# EAGLE design Binary_Blaster_v01 (EAGLE 6.4)
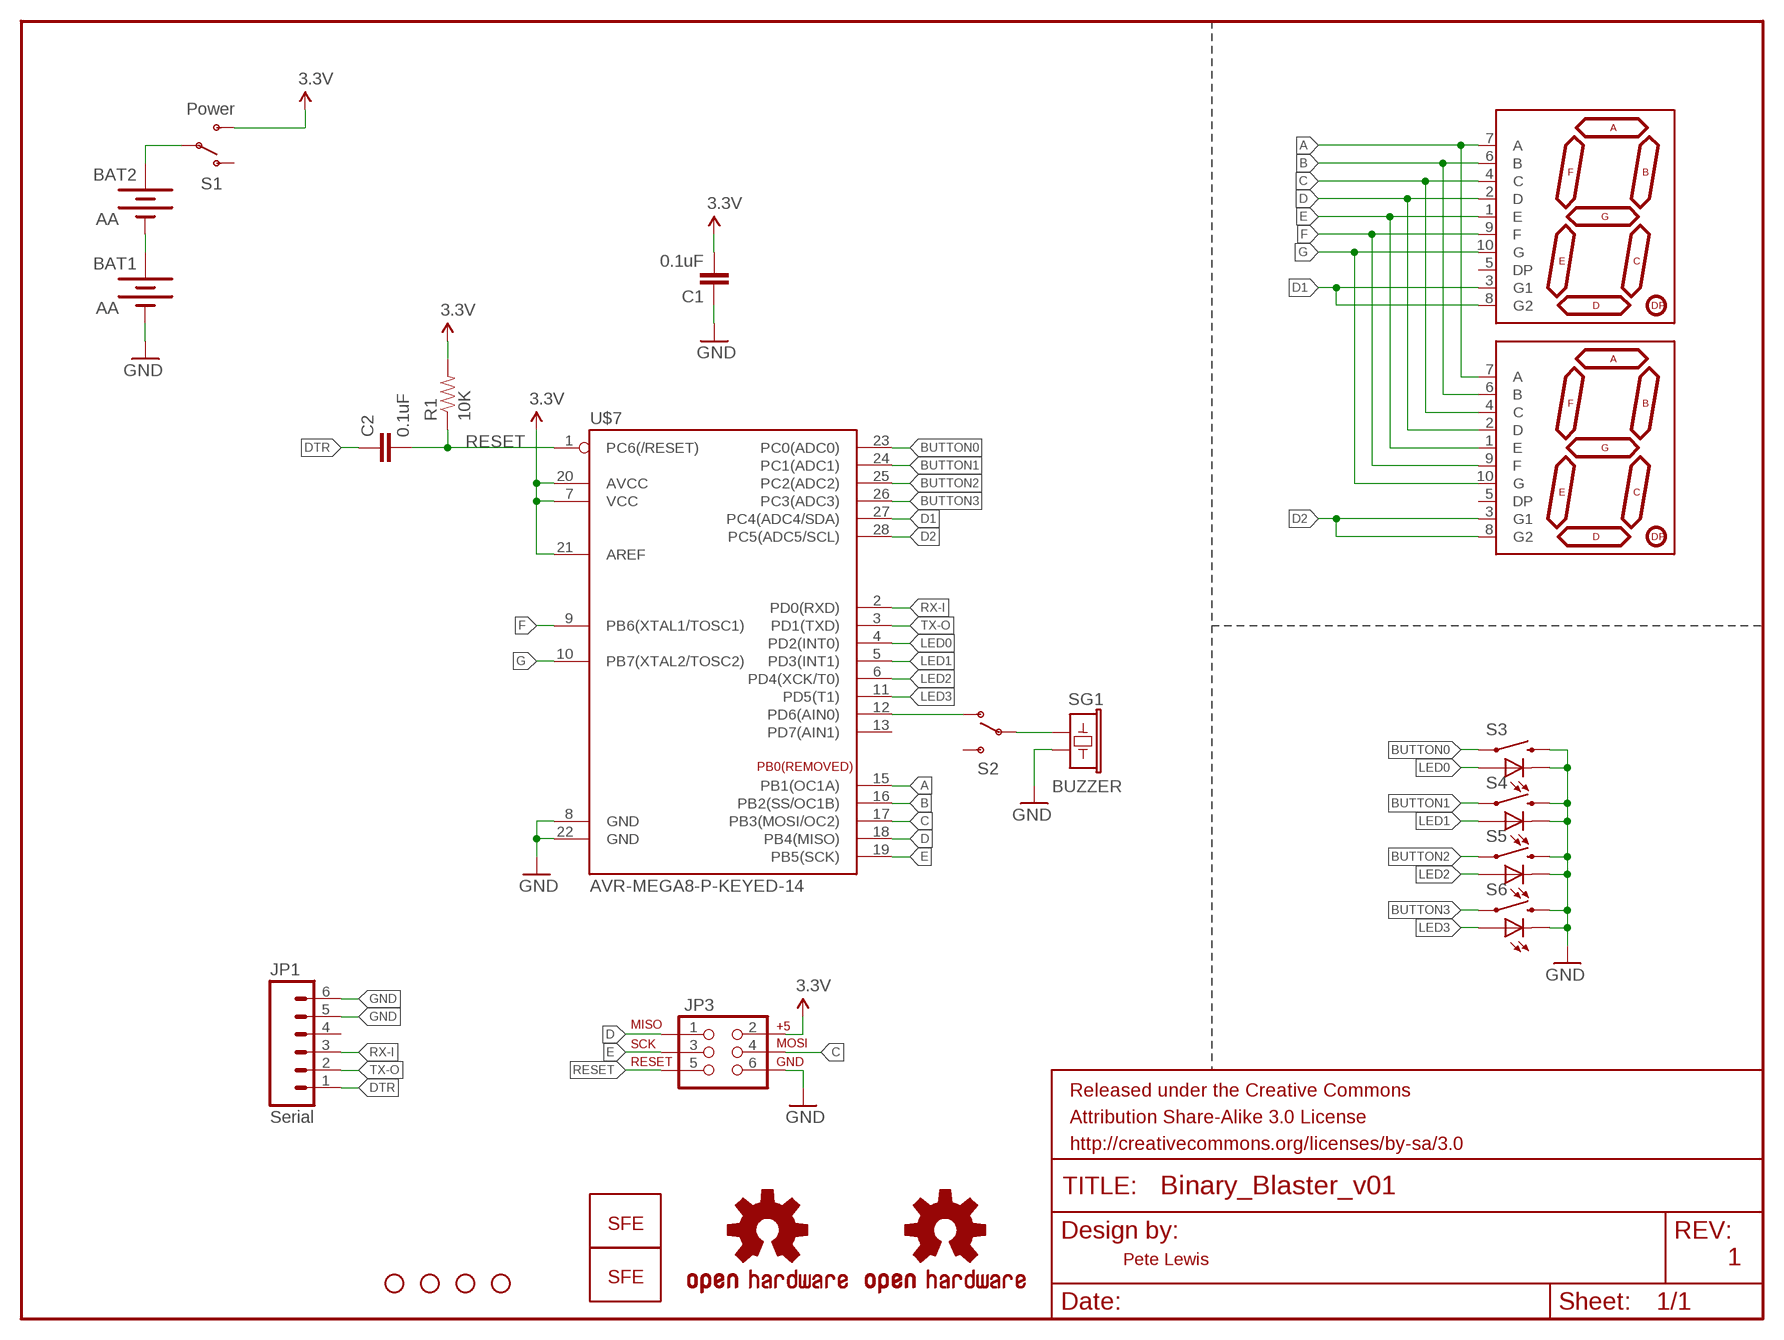
[diagram p0: schematic, sheet 1]

## Parts
BAT1  AA  BATTERYAA-KIT  [BATTERY-AA-KIT]
BAT2  AA  BATTERYAA-KIT  [BATTERY-AA-KIT]
C1  0.1uF  CAPCAP-PTH-SMALL-KIT  [CAP-PTH-SMALL-KIT]
C2  0.1uF  CAPCAP-PTH-SMALL-KIT  [CAP-PTH-SMALL-KIT]
FRAME1  FRAME-LETTER  [CREATIVE_COMMONS]
JP1  Serial  M06-SFENOSILK  [1X06-NOSILK]
JP2  STAND-OFF  [STAND-OFF]
JP3  AVR_SPI_PRG_6NS  [2X3-NS]
JP5  STAND-OFF  [STAND-OFF]
JP6  STAND-OFF  [STAND-OFF]
JP7  STAND-OFF  [STAND-OFF]
LOGO1  LOGO-SFENEW  [SFE-NEW-WEBLOGO]
LOGO2  LOGO-SFENEW  [SFE-NEW-WEBLOGO]
R1  10K  RESISTORKIT  [AXIAL-0.3-KIT]
S1  Power  SWITCH-SPSTKIT  [SWITCH-SPDT_KIT]
S2  SWITCH-SPSTKIT  [SWITCH-SPDT_KIT]
S3  SWITCH-MOMENTARY-LEDPTH  [TACTILE-PTH-LED-12MM]
S4  SWITCH-MOMENTARY-LEDPTH  [TACTILE-PTH-LED-12MM]
S5  SWITCH-MOMENTARY-LEDPTH  [TACTILE-PTH-LED-12MM]
S6  SWITCH-MOMENTARY-LEDPTH  [TACTILE-PTH-LED-12MM]
SG1  BUZZER  BUZZERKIT  [BUZZER-12MM-KIT]
U$2  OSHW-LOGOL  [OSHW-LOGO-L]
U$3  OSHW-LOGOS  [OSHW-LOGO-S]
U$4  7-SEGMENT-DISPLAYPTH  [7-SEGMENT-DISPLAY]
U$5  7-SEGMENT-DISPLAYPTH  [7-SEGMENT-DISPLAY]
U$7  AVR-MEGA8-P-KEYED-14  [DIL28-3_KEYED-14]

## Nets
3.3V: C1.2 JP3.2 R1.P$2 S1.3(S) U$7.7(VCC) U$7.20(AVCC) U$7.21(AREF)
A: U$4.7(A) U$5.7(A) U$7.15(PB1(OC1A))
B: U$4.6(B) U$5.6(B) U$7.16(PB2(SS/OC1B))
BUTTON0: S3.4 U$7.23(PC0(ADC0))
BUTTON1: S4.4 U$7.24(PC1(ADC1))
BUTTON2: S5.4 U$7.25(PC2(ADC2))
BUTTON3: S6.4 U$7.26(PC3(ADC3))
C: JP3.4 U$4.4(C) U$5.4(C) U$7.17(PB3(MOSI/OC2))
D: JP3.1 U$4.2(D) U$5.2(D) U$7.18(PB4(MISO))
D1: U$5.3(G1) U$5.8(G2) U$7.27(PC4(ADC4/SDA))
D2: U$4.3(G1) U$4.8(G2) U$7.28(PC5(ADC5/SCL))
DTR: C2.1 JP1.1
E: JP3.3 U$4.1(E) U$5.1(E) U$7.19(PB5(SCK))
F: U$4.9(F) U$5.9(F) U$7.9(PB6(XTAL1/TOSC1))
G: U$4.10(G) U$5.10(G) U$7.10(PB7(XTAL2/TOSC2))
GND: BAT1.GND@1(-) C1.1 JP1.5 JP1.6 JP3.6 S3.2 S3.C S4.2 S4.C S5.2 S5.C S6.2 S6.C SG1.- U$7.8(GND) U$7.22(GND)
LED0: S3.A U$7.4(PD2(INT0))
LED1: S4.A U$7.5(PD3(INT1))
LED2: S5.A U$7.6(PD4(XCK/T0))
LED3: S6.A U$7.11(PD5(T1))
N$1: S2.2(P) SG1.+
N$2: BAT2.PWR@1(+) S1.2(P)
N$3: S2.1(O) U$7.12(PD6(AIN0))
N$4: BAT1.PWR@1(+) BAT2.GND@1(-)
RESET: C2.2 JP3.5 R1.P$1 U$7.1(PC6(/RESET))
RX-I: JP1.3 U$7.2(PD0(RXD))
TX-O: JP1.2 U$7.3(PD1(TXD))
Unconnected: JP1.4 S1.1(O) S2.3(S) U$4.5(DP) U$5.5(DP) U$7.13(PD7(AIN1))

## Notes on the sheet
- Pete Lewis | 1

## Library data of the parts
BAT1 BAT2 = SparkFun:BATTERY: Battery Holders Various common sizes : AA, AAA, 20mm coin cell and 12mm coin cell.
C1 C2 = SparkFun:CAP: Capacitor Standard 0603 ceramic capacitor, and 0.1" leaded capacitor.
FRAME1 = SparkFun-Aesthetics:FRAME-LETTER: Schematic Frame Standard 8.5x11 US Letter frame
JP1 = unclepetes:M06-SFE: Header 6 Standard 6-pin 0.1" header. Use with straight break away headers (SKU : PRT-00116), right angle break away headers (PRT-00553), swiss pins (PRT-00743), machine pins (PRT-00117), and female headers (PRT-00115). Molex polarized connector foot print use with SKU : PRT-08094 with associated crimp pins and housings. NOTES ON THE VARIANTS LOCK and LOCK_LONGPADS... This footprint was designed to help hold the alignment of a through-hole component (i.e. 6-pin header) while soldering it into place. You may notice that each hole has been shifted either up or down by 0.005 of an inch from it's more standard position (which is a perfectly straight line). This slight alteration caused the pins (the squares in the middle) to touch the edges of the holes. Because they are alternating, it causes a "brace" to hold the component in place. 0.005 has proven to be the perfect amount of "off-center" position when using our standard breakaway headers. Although looks a little odd when you look at the bare footprint, once you have a header in there, the alteration is very hard to notice. Also, if you push a header all the way into place, it is covered up entirely on the bottom side. This idea of altering the position of holes to aid alignment will be further integrated into the Sparkfun Library for other footprints. It can help hold any component with 3 or more connection pins.
JP2 JP5-JP7 = SparkFun:STAND-OFF: Stand Off This is the mechanical footprint for a #4 phillips button head screw. Use the keepout ring to avoid running the screw head into surrounding components. SKU : PRT-00447
JP3 = SparkFun:AVR_SPI_PRG_6: AVR ISP 6 Pin This is the reduced ISP connector for AVR programming. Common on Arduino. This footprint will take up less PCB space and can be used with a 10-pin to 6-pin adapter such as SKU: BOB-08508
LOGO1 LOGO2 = SparkFun-Aesthetics:LOGO-SFE: Spark Fun Electronics PCB Logo This is the standard Spark Fun Electronics PCB logo.
R1 = SparkFun:RESISTOR: Resistor Basic schematic elements and footprints for 0603, 1206, and PTH resistors.
S1 S2 = SparkFun:SWITCH-SPST: SPST Switch Simple slide switch. Spark Fun Electronics SKU : COM-00102
S3-S6 = SparkFun-Electromechanical:SWITCH-MOMENTARY-LED
SG1 = SparkFun:BUZZER: Buzzer 12mm Spark Fun Electronics SKU : Comp-Buzzer
U$2 U$3 = SparkFun:OSHW-LOGO: Open Source Hardware Logo This logo indicates the piece of hardware it is found on incorporates a OSHW license and/or adheres to the definition of open source hardware found here: http://freedomdefined.org/OSHW
U$4 U$5 = SparkFun-Displays:7-SEGMENT-DISPLAY
U$7 = Testing:AVR-MEGA8-P-KEYED-14

## Net classes
0 Default: width 0.254 mm
1 Power: width 0.254 mm
3 ButtonSignal: width 0.254 mm

## Board
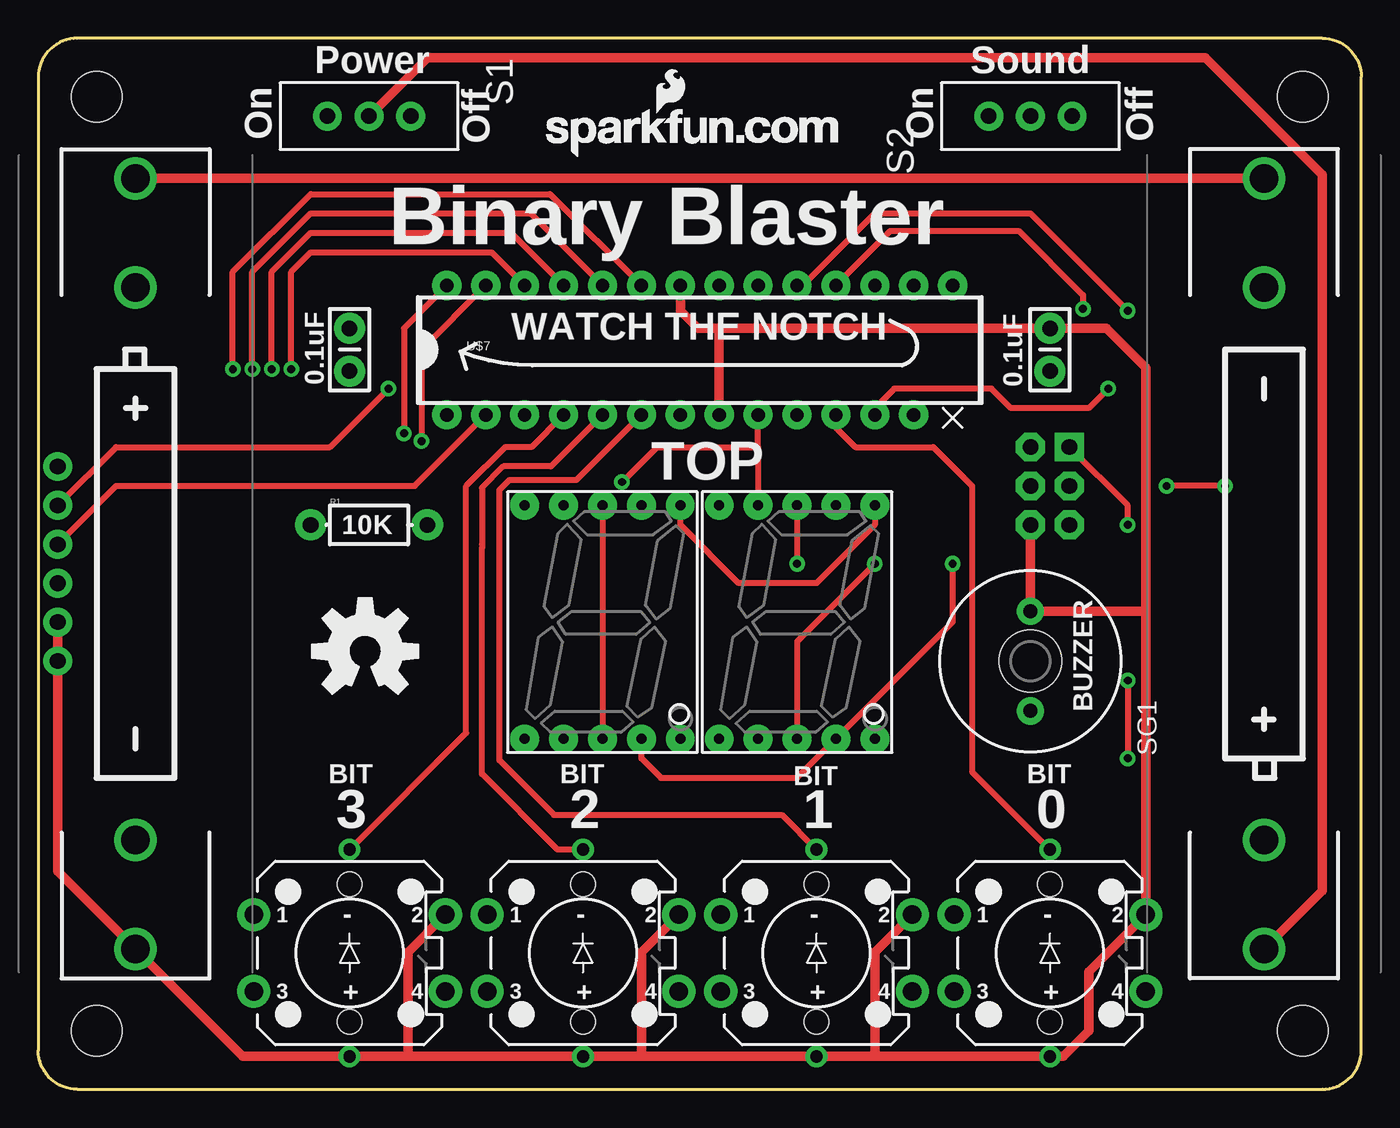
[diagram p1: board, top side]
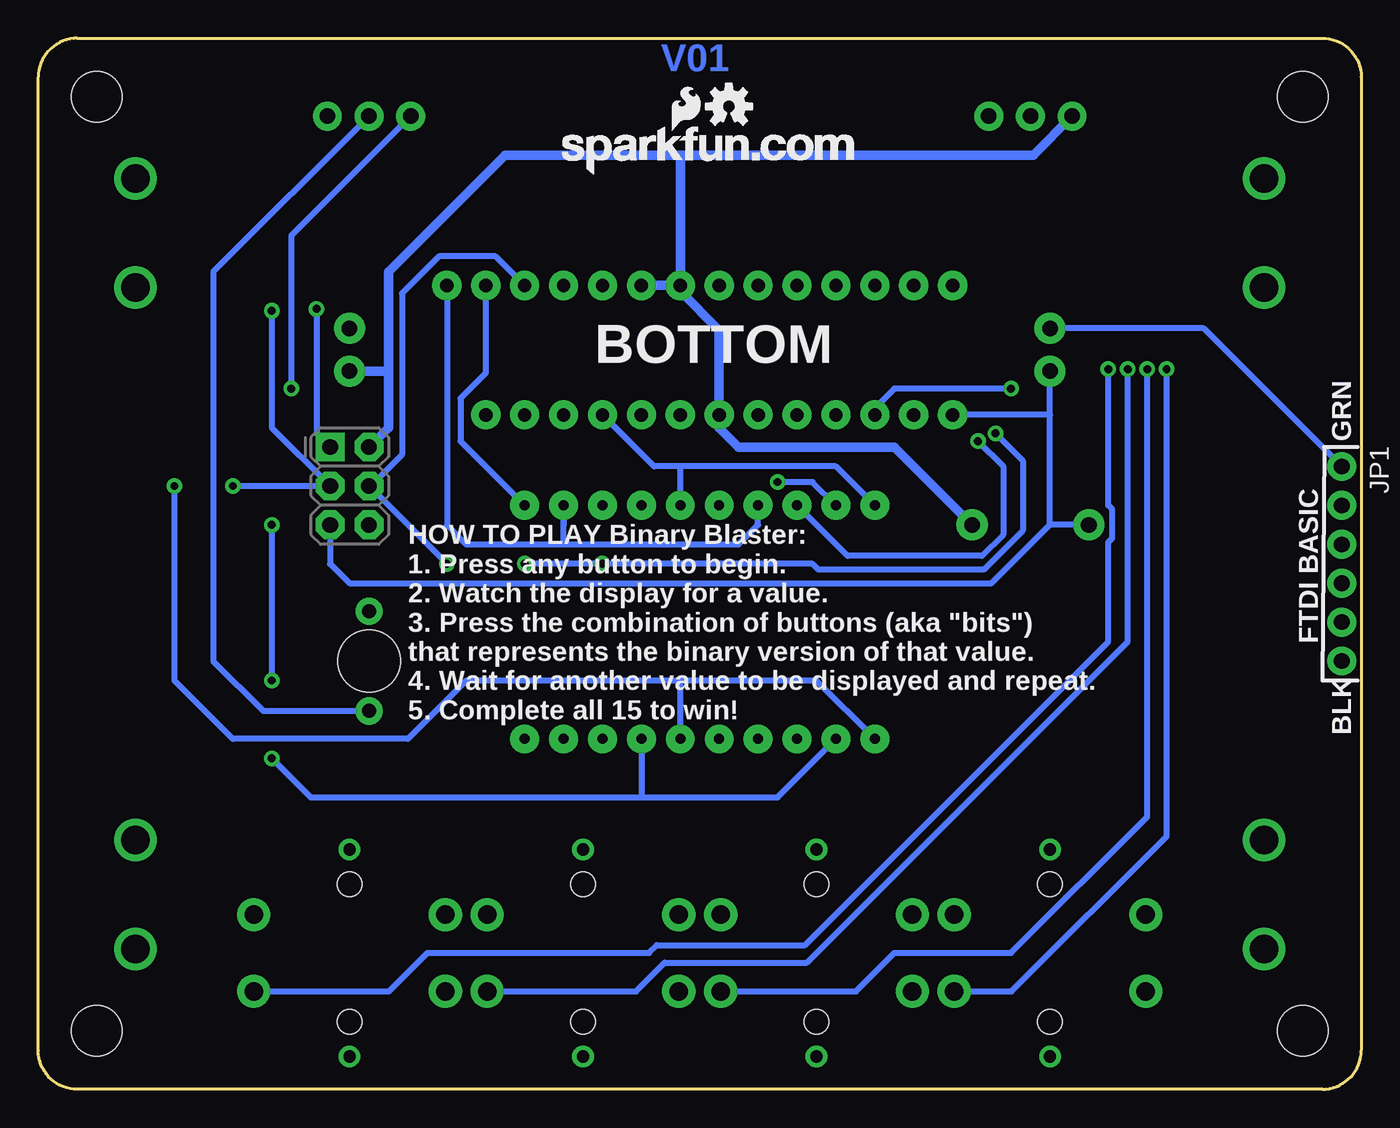
[diagram p2: board, bottom side, seen from below]

Size 86.36 x 68.58 mm. Coordinates in mm from the lower left corner, seen from the top.
Outline: 2.54,0 arc-90 0,2.54 0,66.04 arc-90 2.54,68.58 83.82,68.58 arc-90 86.36,66.04 86.36,2.54 arc-90 83.82,0 2.54,0
Copper layers (1*16): Top 0.035mm / dielectric 1.5mm / Bottom 0.035mm
Design rules "SparkFun *": minimum track width 10mil, minimum drill 20mil, track to track 8mil, track to pad 8mil, pad to pad 8mil, via to via 8mil, smd to smd 8mil, copper to edge 10mil, drill to drill 8mil, minimum pad ring 12mil, minimum via ring 10mil, stop-mask expansion 4mil, vias tented up to drill 25mil, thermal gap 10mil
Holes 4.06 mm at 64.77,27.94

### Footprints (pad centres in the part's own frame; a part is rotated, then mirrored left to right if it is on the bottom)
BATTERY-AA-KIT = drill 1.854: GND@1 25.146,0; GND@2 18.034,0; PWR@1 -25.146,0; PWR@2 -18.034,0
CAP-PTH-SMALL-KIT = drill 1.016 pad 2.032: 1 -0.127,0; 2 2.667,0
1X06-NOSILK = drill 1.016 pad 1.88: 1 0,0; 2 2.54,0; 3 5.08,0; 4 7.62,0; 5 10.16,0; 6 12.7,0
STAND-OFF = hole 3.302: 0,0
2X3-NS = drill 1.016 pad 1.88 square: 1 -2.54,-1.27 | drill 1.016 pad 1.88 octagon: 2 -2.54,1.27; 3 0,-1.27; 4 0,1.27; 5 2.54,-1.27; 6 2.54,1.27
AXIAL-0.3-KIT = drill 1.016 pad 2.032: P$1 -3.81,0; P$2 3.81,0
SWITCH-SPDT_KIT = drill 1.016 pad 1.88: 1 0,2.718; 2 0,0; 3 0,-2.718
TACTILE-PTH-LED-12MM = drill 1.2 pad 2.159: 1 -6.25,2.5; 2 6.25,2.5; 3 -6.25,-2.5; 4 6.25,-2.5 | drill 0.8: A 0,6.75; C 0,-6.75 | hole 1.6: 0,4.5; 0,-4.5
BUZZER-12MM-KIT = drill 0.9 pad 1.778: + 3.25,0; - -3.25,0
7-SEGMENT-DISPLAY = drill 0.65 pad 1.88: 1 -5.08,-7.62; 2 -2.54,-7.62; 3 0,-7.62; 4 2.54,-7.62; 5 5.08,-7.62; 6 5.08,7.62; 7 2.54,7.62; 8 0,7.62; 9 -2.54,7.62; 10 -5.08,7.62
DIL28-3_KEYED-14 = drill 0.864 pad 1.905: 1 -16.51,-4.255; 2 -13.97,-4.255; 3 -11.43,-4.255; 4 -8.89,-4.255; 5 -6.35,-4.255; 6 -3.81,-4.255; 7 -1.27,-4.255; 8 1.27,-4.255; 9 3.81,-4.255; 10 6.35,-4.255; 11 8.89,-4.255; 12 11.43,-4.255; 13 13.97,-4.255; 15 16.51,4.191; 16 13.97,4.191; 17 11.43,4.191; 18 8.89,4.191; 19 6.35,4.191; 20 3.81,4.191; 21 1.27,4.191; 22 -1.27,4.191; 23 -3.81,4.191; 24 -6.35,4.191; 25 -8.89,4.191; 26 -11.43,4.191; 27 -13.97,4.191; 28 -16.51,4.191

### Placement (x,y rotation side)
BAT1  6.35,34.29 270 top
BAT2  80.01,34.29 90 top
C1  66.04,49.53 270 top
C2  20.32,49.53 270 top
FRAME1  -135.36,0 0 top  (outside the outline)
JP1  1.27,40.64 270 bottom
JP2  82.55,3.81 0 top
JP3  66.04,39.37 270 bottom
JP5  3.81,64.77 0 top
JP6  82.55,64.77 0 top
JP7  3.81,3.81 0 top
LOGO1  33.15,60.83 0 top
LOGO2  52.2,59.69 0 bottom
R1  21.59,36.83 0 top
S1  21.59,63.5 270 top
S2  64.77,63.5 90 top
S3  20.32,8.89 0 top
S4  35.56,8.89 0 top
S5  50.8,8.89 0 top
S6  66.04,8.89 0 top
SG1  64.77,27.94 270 top
U$2  21.34,28.57 0 top
U$3  41.27,64.14 0 bottom
U$4  49.53,30.48 0 top
U$5  36.83,30.48 0 top
U$7  43.18,48.26 0 top

### Tracks (layer width: path | path; a pad name or v marks a point on that pad's centre or on a via)
3.3V
  Bottom 0.61: S1.3 21.41,60.96 44.45,60.96 | U$7.21 U$7.20 | U$7.21 44.45,52.07 41.91,49.53 U$7.7 41.91,43.18 40.64,41.91 30.48,41.91 R1.P$2 | 44.45,60.96 55.88,60.96 63.5,53.34 63.5,46.99 | U$7.21 44.45,60.96 | JP3.2 63.5,43.18 63.5,46.99 | C1.2 63.63,46.86 arc-90 63.5,46.99
A
  Bottom 0.406: U$7.15 59.69,36.83 58.42,35.56 52.07,35.56 | 52.07,35.56 U$4.7 52.07,36.83 | 52.07,35.56 40.64,35.56 39.37,36.83 U$5.7
B
  Top 0.406: U$4.6 54.61,36.83 50.8,33.02 45.72,33.02 41.91,36.83 U$5.6
  Bottom 0.406: U$7.16 57.15,46.74 58.8,45.09 58.8,42.29 U$4.6
BUTTON0  (via drill 0.51)
  Top 0.406: U$7.23 33.4,58.42 17.78,58.42 12.7,53.34 v12.7,46.99
  Bottom 0.406: S3.4 22.82,6.39 12.7,16.51 v12.7,46.99
BUTTON1  (via drill 0.51)
  Top 0.406: v13.97,46.99 13.97,53.34 17.78,57.15 32.13,57.15 U$7.24
  Bottom 0.406: S4.4 32.98,6.39 30.48,8.89 22.86,8.89 13.97,17.78 v13.97,46.99
BUTTON2  (via drill 0.51)
  Top 0.406: v15.24,46.99 15.24,53.34 17.78,55.88 30.86,55.88 U$7.25
  Bottom 0.406: S5.4 47.33,6.39 45.47,8.26 36.2,8.26 15.24,29.21 v15.24,46.99
BUTTON3  (via drill 0.51)
  Top 0.406: v16.51,46.99 16.51,53.34 17.78,54.61 29.59,54.61 U$7.26
  Bottom 0.406: S6.4 63.46,6.39 60.96,8.89 46.48,8.89 45.97,9.4 36.32,9.4 16.51,29.21 16.51,35.69 16.26,35.94 16.26,37.85 16.51,38.1 v16.51,46.99
C  (via drill 0.51)
  Top 0.406: U$5.4 39.37,21.59 40.64,20.32 49.53,20.32 U$4.4 59.69,30.48 v59.69,34.29
  Bottom 0.406: U$7.17 56.52,54.36 60.2,54.36 62.61,51.94 62.61,41.4 64.64,39.37 | 64.64,39.37 JP3.4 | 64.64,39.37 64.64,39.24 v59.69,34.29
D  (via drill 0.51)
  Top 0.406: U$7.18 55.63,56.01 64.01,56.01 68.2,51.82 v68.2,50.93 | v71.12,26.67 v71.12,21.59 | v71.12,36.83 71.12,38.1 JP3.1
  Bottom 0.406: U$5.2 38.1,19.05 46.99,19.05 | v68.2,50.93 68.2,42.8 JP3.1 | v71.12,36.83 v71.12,26.67 | v71.12,21.59 68.58,19.05 46.99,19.05 | U$4.2 46.99,19.05
D1  (via drill 0.51)
  Top 0.406: U$5.8 U$5.3 | U$7.27 25.02,48.26 v25.02,42.29
  Bottom 0.406: v25.02,42.29 23.37,40.64 23.37,36.2 24.77,34.8 33.53,34.8 U$5.8
D2  (via drill 0.51)
  Top 0.406: U$4.8 v49.53,34.29 | v54.61,34.29 49.53,29.21 U$4.3 | U$7.28 23.88,49.66 v23.88,42.8
  Bottom 0.406: v54.61,34.29 v49.53,34.29 35.81,34.29 35.43,33.91 24.64,33.91 22.1,36.45 22.1,41.02 v23.88,42.8
DTR
  Bottom 0.406: JP1.1 10.29,49.66 C2.1
E  (via drill 0.51)
  Top 0.406: U$7.19 49.91,52.45 54.61,57.15 64.77,57.15 v71.12,50.8 | v77.47,39.37 v73.66,39.37
  Bottom 0.406: U$5.1 35.56,26.67 44.45,26.67 | v71.12,50.8 71.12,43.18 JP3.3 v73.66,39.37 | 44.45,26.67 58.42,26.67 62.23,22.86 73.66,22.86 77.47,26.67 v77.47,39.37 | U$4.1 44.45,26.67
F  (via drill 0.51)
  Top 0.406: v38.1,39.62 40.39,41.91 46.99,41.91 | 46.99,41.91 U$7.9 | 46.99,41.91 U$4.9
  Bottom 0.406: U$5.9 35.81,39.62 v38.1,39.62
G
  Bottom 0.406: U$5.10 34.29,40.64 44.45,40.64 | 44.45,40.64 46.16,40.64 U$7.10 | U$4.10 44.45,40.64
GND
  Top 0.61: 24.13,2.14 S3.C 13.35,2.14 BAT1.GND@1 1.27,14.22 JP1.6 JP1.5 | 24.13,2.14 S4.C 39.37,2.14 | 39.37,2.14 S5.C 54.61,2.14 | 54.61,2.14 S6.C 66.91,2.14 68.58,3.81 68.58,7.68 S6.2 72.29,31.19 | S5.2 54.61,8.95 54.61,2.14 | S4.2 39.37,8.95 39.37,2.14 | S3.2 24.13,8.95 24.13,2.14 | 72.29,31.19 72.29,47.09 69.72,49.66 C1.1 44.45,49.66 | 44.45,49.66 43.05,49.66 41.91,50.8 U$7.22 | U$7.8 44.45,49.66 | 72.29,31.19 SG1.- JP3.6
LED0
  Top 0.406: U$7.4 32.19,41.91 30.48,41.91 27.94,39.37 27.94,23.26 S3.A
LED1
  Top 0.406: S4.A 33.89,15.64 28.96,20.57 28.96,35.31 28.96,35.56 28.96,39.24 30.35,40.64 33.47,40.64 U$7.5
LED2
  Top 0.406: U$7.6 35.12,39.75 30.73,39.75 30.1,39.12 30.1,21.46 33.66,17.91 48.53,17.91 S5.A
LED3
  Top 0.406: U$7.11 52.07,43.18 53.34,41.91 58.42,41.91 60.96,39.37 60.96,20.72 S6.A
N$1
  Bottom 0.406: S2.2 74.93,53.34 74.93,27.94 71.68,24.69 SG1.+
N$2
  Top 0.61: BAT2.PWR@1 83.82,12.95 83.82,59.69 76.2,67.31 25.4,67.31 S1.2
N$3  (via drill 0.51)
  Top 0.406: v69.85,45.72 68.58,44.45 63.5,44.45 62.23,45.72 55.88,45.72 54.61,44.45 U$7.12
  Bottom 0.406: S2.1 69.85,55.7 v69.85,45.72
N$4
  Top 0.61: BAT1.PWR@1 BAT2.GND@1
RESET
  Bottom 0.406: 20.32,44.01 U$7.1 | 20.32,36.83 20.32,44.01 | 20.32,44.01 C2.2 | JP3.5 67.31,34.29 66.04,33.02 24.13,33.02 20.32,36.83 | R1.P$1 20.32,36.83
RX-I
  Top 0.406: JP1.3 5.08,39.37 24.57,39.37 U$7.2
TX-O  (via drill 0.51)
  Top 0.406: JP1.2 5.08,41.91 19.05,41.91 v22.86,45.72
  Bottom 0.406: v22.86,45.72 30.48,45.72 31.75,44.45 U$7.3

### Text on the board
Bottom: V01
tPlace: Power | Sound | On | Off | On | Off | Binary Blaster | WATCH THE NOTCH | 0.1uF | 0.1uF | TOP | BUZZER | BIT | BIT | BIT | BIT | 3 | 2 | 1 | 0
bPlace: BOTTOM | GRN | FTDI BASIC | HOW TO PLAY Binary Blaster: / 1. Press any button to begin. / 2. Watch the display for a value. / 3. Press the combination of buttons (aka "bits") / that represents the binary version of that value. / 4. Wait for another value to be displayed and repeat. / 5. Complete all 15 to win! | BLK
tValues: Clip